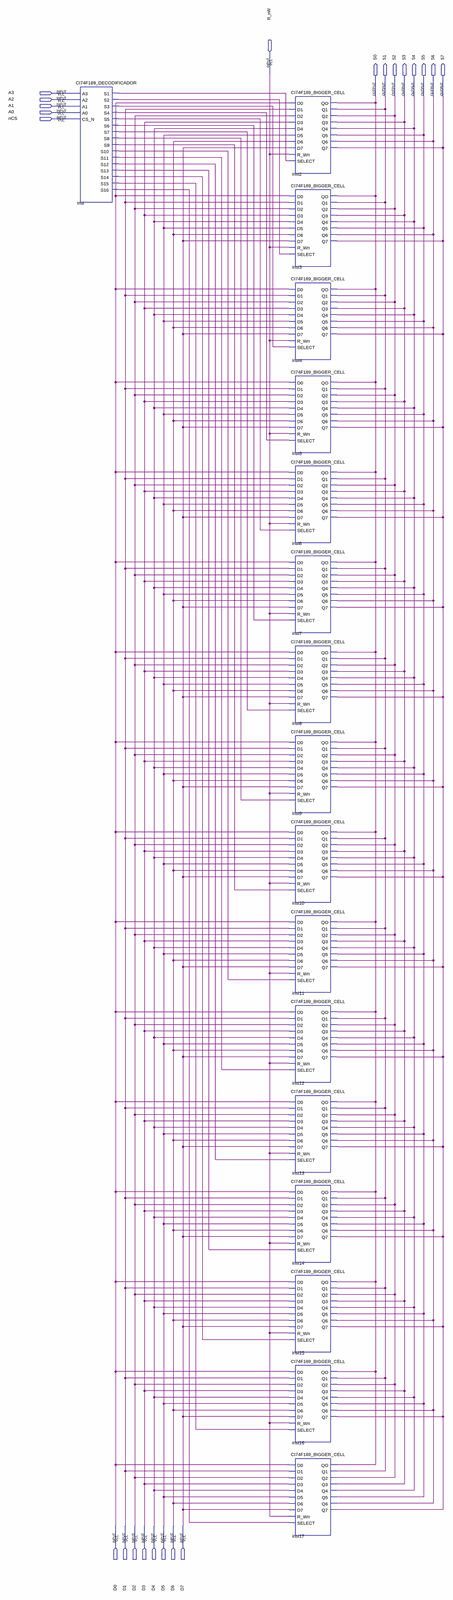
[diagram p0: schematic sheet, whole]
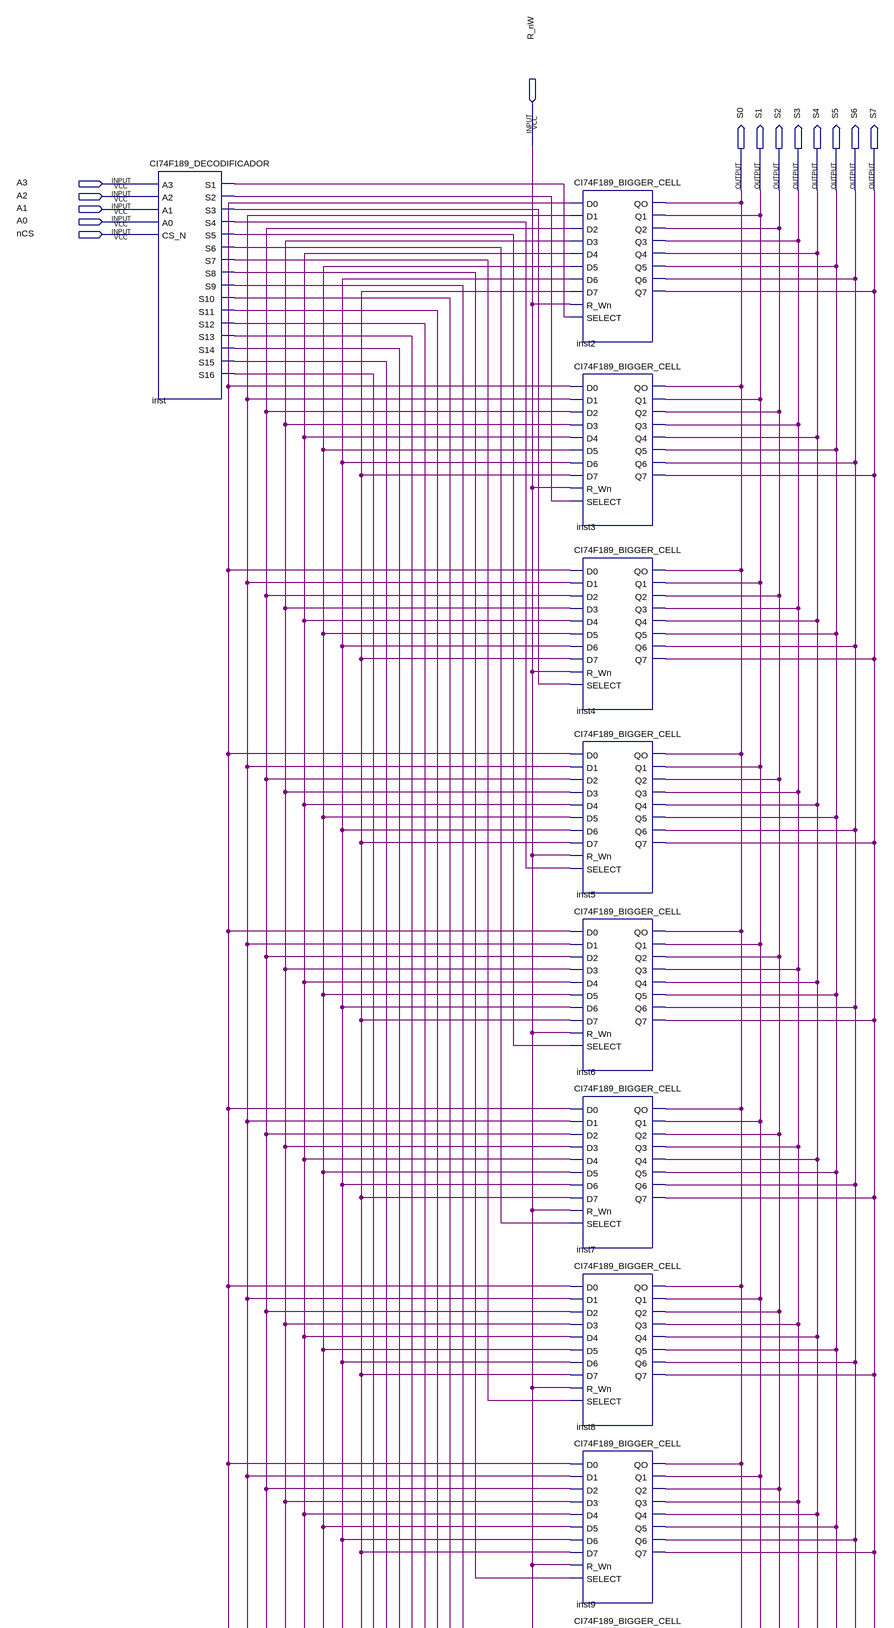
[diagram p1: schematic sheet, upper part]
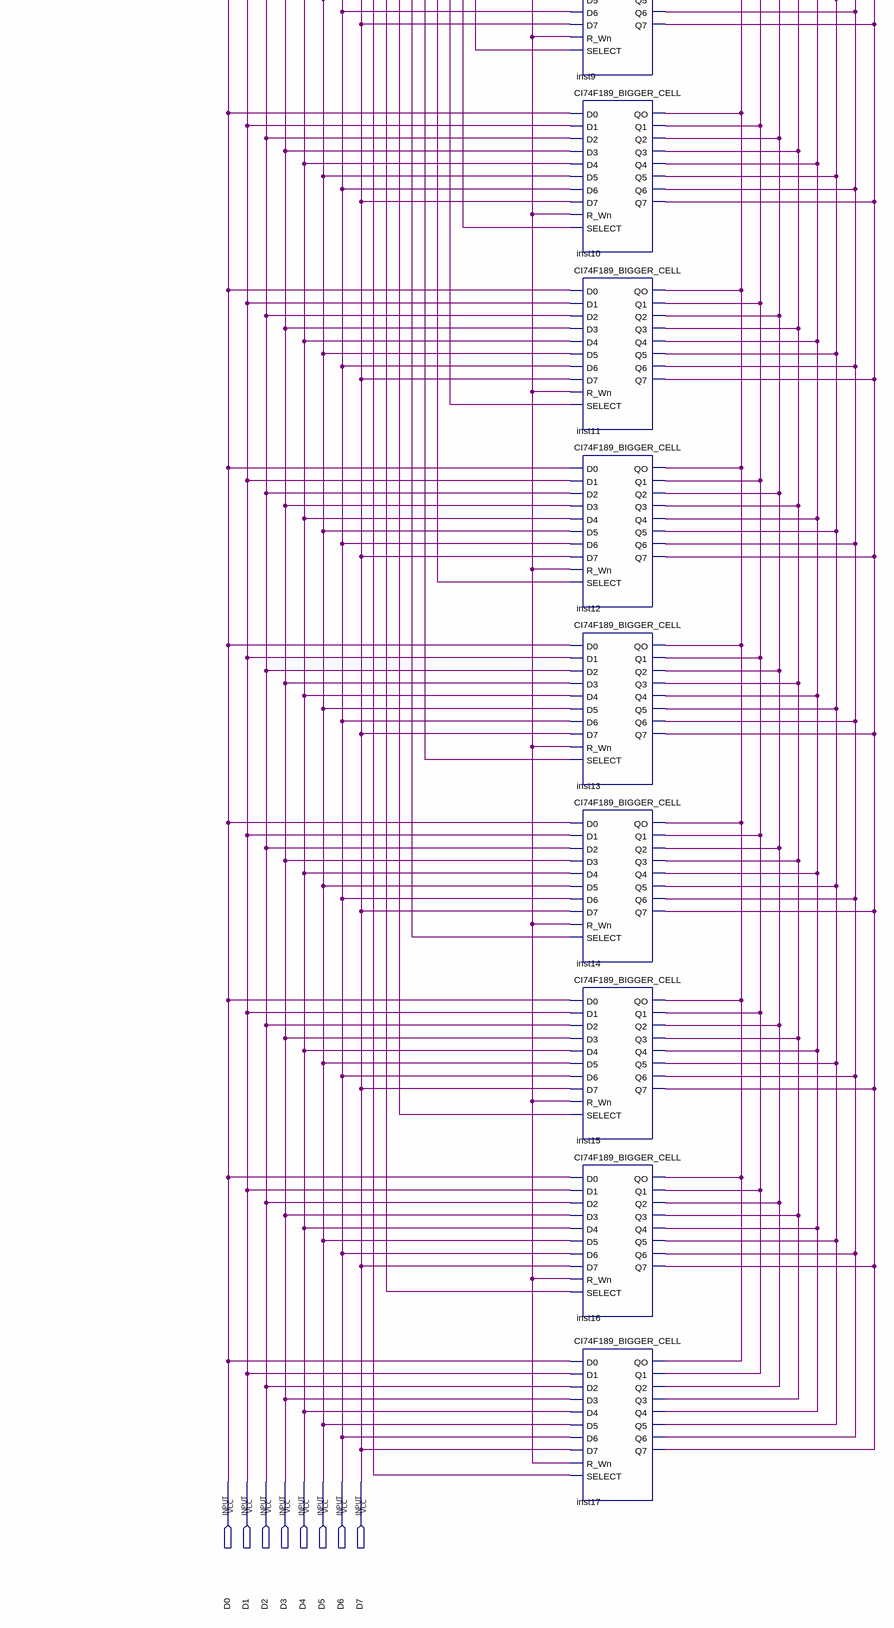
[diagram p2: schematic sheet, lower part]
// Quartus schematic MEMORIA_RAM.bdf as structural Verilog: 17 symbols, 22 pins
module MEMORIA_RAM (
  input  R_nW,
  input  A3,
  input  A2,
  input  A1,
  input  A0,
  input  nCS,
  input  D0,
  input  D1,
  input  D2,
  input  D3,
  input  D4,
  input  D5,
  input  D6,
  input  D7,
  output S0,
  output S1,
  output S2,
  output S3,
  output S4,
  output S5,
  output S6,
  output S7
);

  wire inst_s1, inst_s2, inst_s3, inst_s4, inst_s5, inst_s6, inst_s7, inst_s8, inst_s9, inst_s10, inst_s11,
       inst_s12, inst_s13, inst_s14, inst_s15, inst_s16;

  CI74F189_DECODIFICADOR inst (
    .A0(A0), .A3(A3), .A2(A2), .A1(A1), .CS_N(nCS), .S1(inst_s1), .S2(inst_s2), .S3(inst_s3), .S4(inst_s4),
    .S5(inst_s5), .S6(inst_s6), .S7(inst_s7), .S8(inst_s8), .S9(inst_s9), .S10(inst_s10), .S11(inst_s11),
    .S12(inst_s12), .S13(inst_s13), .S14(inst_s14), .S15(inst_s15), .S16(inst_s16));
  CI74F189_BIGGER_CELL inst2 (
    .D0(D0), .D1(D1), .D2(D2), .D3(D3), .D4(D4), .D5(D5), .D6(D6), .D7(D7), .R_Wn(R_nW), .SELECT(inst_s1),
    .QO(S0), .Q1(S1), .Q2(S2), .Q3(S3), .Q4(S4), .Q5(S5), .Q6(S6), .Q7(S7));
  CI74F189_BIGGER_CELL inst3 (
    .D0(D0), .D1(D1), .D2(D2), .D3(D3), .D4(D4), .D5(D5), .D6(D6), .D7(D7), .R_Wn(R_nW), .SELECT(inst_s2),
    .QO(S0), .Q1(S1), .Q2(S2), .Q3(S3), .Q4(S4), .Q5(S5), .Q6(S6), .Q7(S7));
  CI74F189_BIGGER_CELL inst4 (
    .D0(D0), .D1(D1), .D2(D2), .D3(D3), .D4(D4), .D5(D5), .D6(D6), .D7(D7), .R_Wn(R_nW), .SELECT(inst_s3),
    .QO(S0), .Q1(S1), .Q2(S2), .Q3(S3), .Q4(S4), .Q5(S5), .Q6(S6), .Q7(S7));
  CI74F189_BIGGER_CELL inst5 (
    .D0(D0), .D1(D1), .D2(D2), .D3(D3), .D4(D4), .D5(D5), .D6(D6), .D7(D7), .R_Wn(R_nW), .SELECT(inst_s4),
    .QO(S0), .Q1(S1), .Q2(S2), .Q3(S3), .Q4(S4), .Q5(S5), .Q6(S6), .Q7(S7));
  CI74F189_BIGGER_CELL inst6 (
    .D0(D0), .D1(D1), .D2(D2), .D3(D3), .D4(D4), .D5(D5), .D6(D6), .D7(D7), .R_Wn(R_nW), .SELECT(inst_s5),
    .QO(S0), .Q1(S1), .Q2(S2), .Q3(S3), .Q4(S4), .Q5(S5), .Q6(S6), .Q7(S7));
  CI74F189_BIGGER_CELL inst7 (
    .D0(D0), .D1(D1), .D2(D2), .D3(D3), .D4(D4), .D5(D5), .D6(D6), .D7(D7), .R_Wn(R_nW), .SELECT(inst_s6),
    .QO(S0), .Q1(S1), .Q2(S2), .Q3(S3), .Q4(S4), .Q5(S5), .Q6(S6), .Q7(S7));
  CI74F189_BIGGER_CELL inst8 (
    .D0(D0), .D1(D1), .D2(D2), .D3(D3), .D4(D4), .D5(D5), .D6(D6), .D7(D7), .R_Wn(R_nW), .SELECT(inst_s7),
    .QO(S0), .Q1(S1), .Q2(S2), .Q3(S3), .Q4(S4), .Q5(S5), .Q6(S6), .Q7(S7));
  CI74F189_BIGGER_CELL inst9 (
    .D0(D0), .D1(D1), .D2(D2), .D3(D3), .D4(D4), .D5(D5), .D6(D6), .D7(D7), .R_Wn(R_nW), .SELECT(inst_s8),
    .QO(S0), .Q1(S1), .Q2(S2), .Q3(S3), .Q4(S4), .Q5(S5), .Q6(S6), .Q7(S7));
  CI74F189_BIGGER_CELL inst10 (
    .D0(D0), .D1(D1), .D2(D2), .D3(D3), .D4(D4), .D5(D5), .D6(D6), .D7(D7), .R_Wn(R_nW), .SELECT(inst_s9),
    .QO(S0), .Q1(S1), .Q2(S2), .Q3(S3), .Q4(S4), .Q5(S5), .Q6(S6), .Q7(S7));
  CI74F189_BIGGER_CELL inst11 (
    .D0(D0), .D1(D1), .D2(D2), .D3(D3), .D4(D4), .D5(D5), .D6(D6), .D7(D7), .R_Wn(R_nW), .SELECT(inst_s10),
    .QO(S0), .Q1(S1), .Q2(S2), .Q3(S3), .Q4(S4), .Q5(S5), .Q6(S6), .Q7(S7));
  CI74F189_BIGGER_CELL inst12 (
    .D0(D0), .D1(D1), .D2(D2), .D3(D3), .D4(D4), .D5(D5), .D6(D6), .D7(D7), .R_Wn(R_nW), .SELECT(inst_s11),
    .QO(S0), .Q1(S1), .Q2(S2), .Q3(S3), .Q4(S4), .Q5(S5), .Q6(S6), .Q7(S7));
  CI74F189_BIGGER_CELL inst13 (
    .D0(D0), .D1(D1), .D2(D2), .D3(D3), .D4(D4), .D5(D5), .D6(D6), .D7(D7), .R_Wn(R_nW), .SELECT(inst_s12),
    .QO(S0), .Q1(S1), .Q2(S2), .Q3(S3), .Q4(S4), .Q5(S5), .Q6(S6), .Q7(S7));
  CI74F189_BIGGER_CELL inst14 (
    .D0(D0), .D1(D1), .D2(D2), .D3(D3), .D4(D4), .D5(D5), .D6(D6), .D7(D7), .R_Wn(R_nW), .SELECT(inst_s13),
    .QO(S0), .Q1(S1), .Q2(S2), .Q3(S3), .Q4(S4), .Q5(S5), .Q6(S6), .Q7(S7));
  CI74F189_BIGGER_CELL inst15 (
    .D0(D0), .D1(D1), .D2(D2), .D3(D3), .D4(D4), .D5(D5), .D6(D6), .D7(D7), .R_Wn(R_nW), .SELECT(inst_s14),
    .QO(S0), .Q1(S1), .Q2(S2), .Q3(S3), .Q4(S4), .Q5(S5), .Q6(S6), .Q7(S7));
  CI74F189_BIGGER_CELL inst16 (
    .D0(D0), .D1(D1), .D2(D2), .D3(D3), .D4(D4), .D5(D5), .D6(D6), .D7(D7), .R_Wn(R_nW), .SELECT(inst_s15),
    .QO(S0), .Q1(S1), .Q2(S2), .Q3(S3), .Q4(S4), .Q5(S5), .Q6(S6), .Q7(S7));
  CI74F189_BIGGER_CELL inst17 (
    .D0(D0), .D1(D1), .D2(D2), .D3(D3), .D4(D4), .D5(D5), .D6(D6), .D7(D7), .R_Wn(R_nW), .SELECT(inst_s16),
    .QO(S0), .Q1(S1), .Q2(S2), .Q3(S3), .Q4(S4), .Q5(S5), .Q6(S6), .Q7(S7));
endmodule
